# EAGLE design design_block (EAGLE 9.3.0)
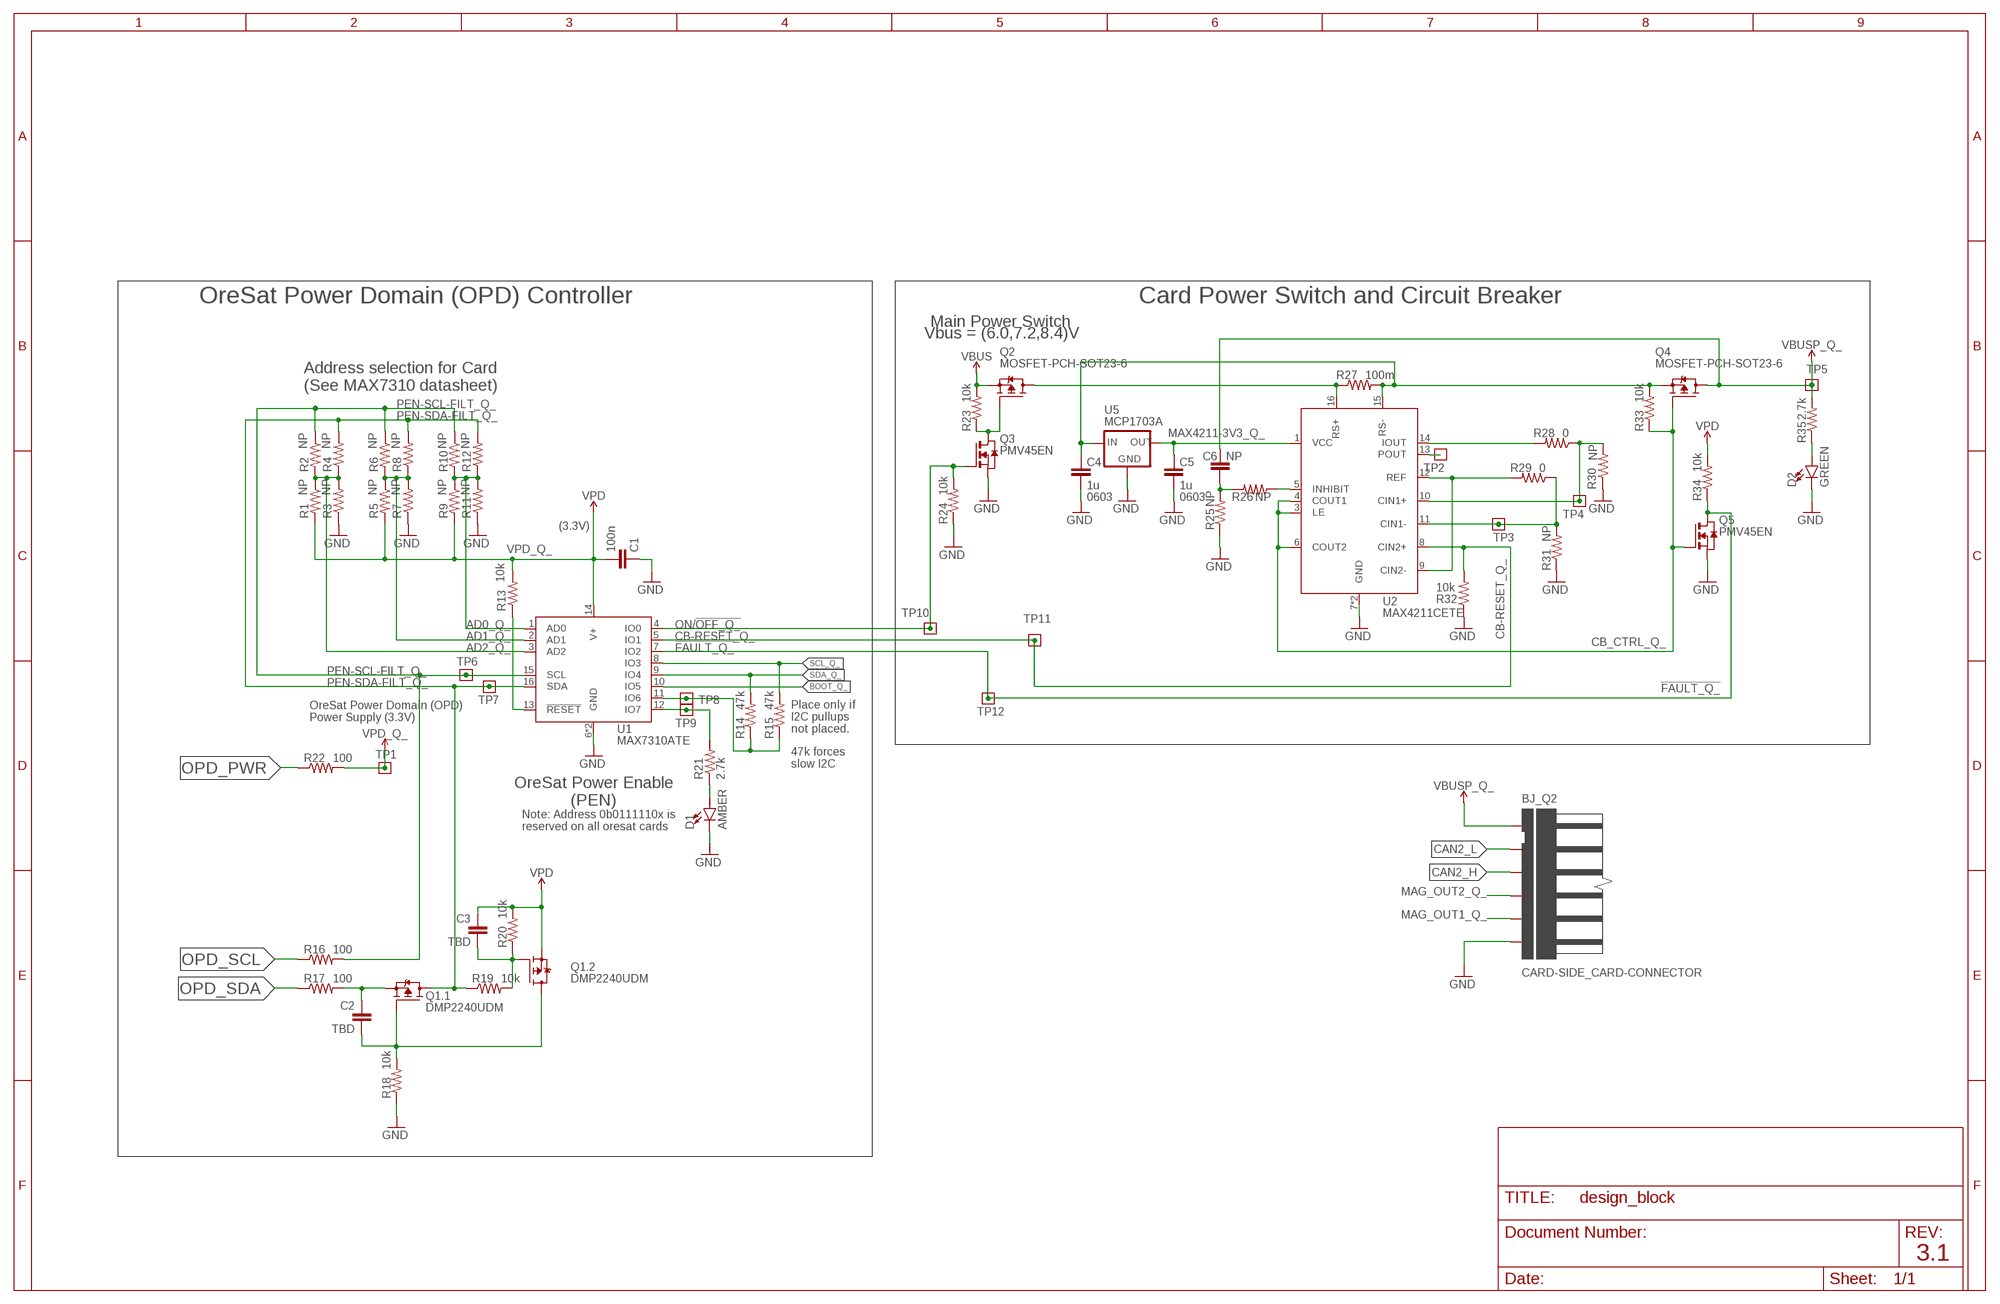
[diagram p0: schematic, sheet 1]

## Parts
BJ_Q2  CARD-SIDE_CARD-CONNECTOR  [14-PIN_FFC-PORT]
C1  100n  C-EU0402-B-NOSILK  [.0402-B-NOSILK]
C2  TBD  C-EU0402-B-NOSILK  [.0402-B-NOSILK]
C3  TBD  C-EU0402-B-NOSILK  [.0402-B-NOSILK]
C4  1u  C-EU0603-B-NOSILK  [.0603-B-NOSILK]
C5  1u  C-EU0603-B-NOSILK  [.0603-B-NOSILK]
C6  NP  C-EU0402-B-NOSILK  [.0402-B-NOSILK]
D1  AMBER  LED-GREEN0603  [LED-0603]
D2  GREEN  LED-GREEN0603  [LED-0603]
Q1  DMP2240UDM  MOSFET-PCH-SOT23-6  [SOT23-6]
Q2  MOSFET-PCH-SOT23-6  [SOT23-6]
Q3  PMV45EN  [SOT23]
Q4  MOSFET-PCH-SOT23-6  [SOT23-6]
Q5  PMV45EN  [SOT23]
R1  NP  R-US_0402-B-NOSILK  [.0402-B-NOSILK]
R2  NP  R-US_0402-B-NOSILK  [.0402-B-NOSILK]
R3  NP  R-US_0402-B-NOSILK  [.0402-B-NOSILK]
R4  NP  R-US_0402-B-NOSILK  [.0402-B-NOSILK]
R5  NP  R-US_0402-B-NOSILK  [.0402-B-NOSILK]
R6  NP  R-US_0402-B-NOSILK  [.0402-B-NOSILK]
R7  NP  R-US_0402-B-NOSILK  [.0402-B-NOSILK]
R8  NP  R-US_0402-B-NOSILK  [.0402-B-NOSILK]
R9  NP  R-US_0402-B-NOSILK  [.0402-B-NOSILK]
R10  NP  R-US_0402-B-NOSILK  [.0402-B-NOSILK]
R11  NP  R-US_0402-B-NOSILK  [.0402-B-NOSILK]
R12  NP  R-US_0402-B-NOSILK  [.0402-B-NOSILK]
R13  10k  R-US_0402-B-NOSILK  [.0402-B-NOSILK]
R14  47k  R-US_0402-B-NOSILK  [.0402-B-NOSILK]
R15  47k  R-US_0402-B-NOSILK  [.0402-B-NOSILK]
R16  100  R-US_0402-B-NOSILK  [.0402-B-NOSILK]
R17  100  R-US_0402-B-NOSILK  [.0402-B-NOSILK]
R18  10k  R-US_0402-B-NOSILK  [.0402-B-NOSILK]
R19  10k  R-US_0402-B-NOSILK  [.0402-B-NOSILK]
R20  10k  R-US_0402-B-NOSILK  [.0402-B-NOSILK]
R21  2.7k  R-US_0402-B-NOSILK  [.0402-B-NOSILK]
R22  100  R-US_0402-B-NOSILK  [.0402-B-NOSILK]
R23  10k  R-US_0402-B-NOSILK  [.0402-B-NOSILK]
R24  10k  R-US_0402-B-NOSILK  [.0402-B-NOSILK]
R25  NP  R-US_0402-B-NOSILK  [.0402-B-NOSILK]
R26  NP  R-US_0402-B-NOSILK  [.0402-B-NOSILK]
R27  100m  R-US_R1206  [R1206]
R28  0  R-US_0402-B-NOSILK  [.0402-B-NOSILK]
R29  0  R-US_0402-B-NOSILK  [.0402-B-NOSILK]
R30  NP  R-US_0402-B-NOSILK  [.0402-B-NOSILK]
R31  NP  R-US_0402-B-NOSILK  [.0402-B-NOSILK]
R32  10k  R-US_0402-B-NOSILK  [.0402-B-NOSILK]
R33  10k  R-US_0402-B-NOSILK  [.0402-B-NOSILK]
R34  10k  R-US_0402-B-NOSILK  [.0402-B-NOSILK]
R35  2.7k  R-US_0402-B-NOSILK  [.0402-B-NOSILK]
TP1  TEST-POINT  [2MM-TEST-POINT]
TP2  TEST-POINT  [2MM-TEST-POINT]
TP3  TEST-POINT  [2MM-TEST-POINT]
TP4  TEST-POINT  [2MM-TEST-POINT]
TP5  TEST-POINT  [2MM-TEST-POINT]
TP6  TEST-POINT  [2MM-TEST-POINT]
TP7  TEST-POINT  [2MM-TEST-POINT]
TP8  TEST-POINT  [2MM-TEST-POINT]
TP9  TEST-POINT  [2MM-TEST-POINT]
TP10  TEST-POINT  [2MM-TEST-POINT]
TP11  TEST-POINT  [2MM-TEST-POINT]
TP12  TEST-POINT  [2MM-TEST-POINT]
U1  MAX7310ATE  MAX7310  [QFN65P400X400X80-17T210]
U2  MAX4211CETE  MAX4211  [QFN65P400X400X80-17T210]
U5  MCP1703A  XC63FPM  [SOT23]

## Nets
!FAULT_Q_: Q5.3(D) R34.1 TP12.1 U1.7(IO2)
AD0_Q_: R9.1 R10.2 R11.2 R12.1 U1.1(AD0)
AD1_Q_: R5.1 R6.2 R7.2 R8.1 U1.2(AD1)
AD2_Q_: R1.1 R2.2 R3.2 R4.1 U1.3(AD2)
BOOT_Q_: U1.10(IO5)
CAN2_H: BJ_Q2.P$6 BJ_Q2.P$7
CAN2_L: BJ_Q2.P$4 BJ_Q2.P$5
CB-RESET_Q_: R32.2 TP11.1 U1.5(IO1) U2.8(CIN2+)
CB_CTRL_Q_: Q4.3(G) Q5.1(G) R33.1 U2.3(LE) U2.4(COUT1) U2.6(COUT2)
GND: BJ_Q2.P$12 BJ_Q2.P$13 BJ_Q2.P$14 BJ_Q2.P$15 BJ_Q2.P$16 C1.1 C4.2 C5.2 D1.C D2.C Q3.2(S) Q5.2(S) R3.1 R7.1 R11.1 R18.1 R24.1 R25.1 R30.1 R31.1 R32.1 U1.6(GND) U1.EPAD(GND) U2.7(GND) U2.EPAD(GND) U5.1(GND)
MAG_OUT1_Q_: BJ_Q2.P$10 BJ_Q2.P$11
MAG_OUT2_Q_: BJ_Q2.P$8 BJ_Q2.P$9
MAX4211-3V3_Q_: C5.1 U2.1(VCC) U5.2(OUT)
N$2: D2.A R35.1
N$3: R13.1 U1.13(!RESET)
N$4: Q2.3(G) Q3.3(D) R23.1
N$5: Q2.1(D) Q2.2(D) Q2.5(D) Q2.6(D) R27.1 U2.16(RS+)
N$6: R28.1 R30.2 TP4.1 U2.10(CIN1+)
N$7: R29.1 R31.2 TP3.1 U2.11(CIN1-)
N$8: R28.2 U2.14(IOUT)
N$9: R29.2 U2.9(CIN2-) U2.12(REF)
N$10: TP2.1 U2.13(POUT)
N$11: R26.1 U2.5(INHIBIT)
N$12: C6.1 R25.2 R26.2
N$13: C4.1 Q4.4(S) R27.2 R33.2 U2.15(RS-) U5.3(IN)
N$14: R21.2 TP9.1 U1.12(IO7)
N$15: D1.A R21.1
N$16: C2.1 Q1.5(.1:S) R17.2
N$17: C2.2 Q1.1(.1:G) Q1.4(.2:D) R18.2
N$18: C3.2 Q1.3(.2:G) R19.2 R20.1
N$19: R14.1 R15.1 TP8.1 U1.11(IO6)
ON/!OFF_Q_: Q3.1(G) R24.2 TP10.1 U1.4(IO0)
OPD_PWR: R22.1
OPD_SCL: R16.1
OPD_SDA: R17.1
PEN-SCL-FILT_Q_: R2.1 R6.1 R10.1 R16.2 TP6.1 U1.15(SCL)
PEN-SDA-FILT_Q_: Q1.6(.1:D) R4.2 R8.2 R12.2 R19.1 TP7.1 U1.16(SDA)
SCL_Q_: R15.2 U1.8(IO3)
SDA_Q_: R14.2 U1.9(IO4)
VBUS: Q2.4(S) R23.2
VBUSP_Q_: BJ_Q2.P$1 BJ_Q2.P$2 BJ_Q2.P$3 C6.2 Q4.1(D) Q4.2(D) Q4.5(D) Q4.6(D) R35.2 TP5.1
VPD_Q_: C1.2 C3.1 Q1.2(.2:S) R1.2 R5.2 R9.2 R13.2 R20.2 R22.2 R34.2 TP1.1 U1.14(V+) ; supply symbol labelled VPD

## Notes on the sheet
- OreSat Power Domain (OPD) Controller | Card Power Switch and Circuit Breaker
- Main Power Switch
- Vbus = (6.0,7.2,8.4)V
- Address selection for Card
  (See MAX7310 datasheet)
- 0603 | 0603
- (3.3V)
- OreSat Power Domain (OPD)
  Power Supply (3.3V)
- Place only if
  I2C pullups
  not placed.
- 47k forces
  slow I2C
- OreSat Power Enable
  (PEN)
- Note: Address 0b0111110x is 
  reserved on all oresat cards
- 3.1

## Library data of the parts
BJ_Q2 = oresat-ACS_driver_board:CARD-SIDE_CARD-CONNECTOR
C1-C3 C6 = rcl_custom:C-EU: CAPACITOR, European symbol; DIS: Digi-Key; DPN: 1276-1001-1-ND; MFR: Samsung; MPN: CL05B104KO5NNNC
C4 C5 = oresat-rcl:C-EU: CAPACITOR, European symbol; DIS: Digi-Key; DPN: 1276-1001-1-ND; MFR: Samsung; MPN: CL05B104KO5NNNC
D1 = SparkFun-LED:LED-GREEN: Green SMD LED Used in manufacturing of various products at SparkFun Packages: 0603 - SMD 0603 package [Product Link] <http://www.futureelectronics.com/en/technologies/semiconductors/optoelectronics/leds/Pages/9894312-LTST-C190GKT.aspx?CrossPart=HSMG-C190&IM=0> LilyPad 1206 - SMD1206 LilyPad package [Product Link] <http://www.futureelectronics.com/en/Technologies/Product.aspx?ProductID=IN150NGHARVATEKCORPORATION2049943&IM=0> 1206 - SMD1206 package [Product Link] <http://www.futureelectronics.com/en/technologies/semiconductors/optoelectronics/leds/Pages/8315665-LTST-C150KGKT.aspx?IM=0> 1206 Bottom Mount -SMD 1206 Bottom Mount [Product Link] <http://www.digikey.com/product-detail/en/lite-on-inc/LTST-C230KGKT/160-1456-1-ND/386854> SparkFun Products: Pro Mini 328 -5V <https://www.sparkfun.com/products/821> RedBoard <https://www.sparkfun.com/products/12757> MP3 Trigger <https://www.sparkfun.com/products/13720> Makey Makey <https://www.sparkfun.com/products/11076>; VALUE: GREEN
D2 = SparkFun-LED:LED-GREEN: Green SMD LED Used in manufacturing of various products at SparkFun Packages: 0603 - SMD 0603 package [Product Link] <http://www.futureelectronics.com/en/technologies/semiconductors/optoelectronics/leds/Pages/9894312-LTST-C190GKT.aspx?CrossPart=HSMG-C190&IM=0> LilyPad 1206 - SMD1206 LilyPad package [Product Link] <http://www.futureelectronics.com/en/Technologies/Product.aspx?ProductID=IN150NGHARVATEKCORPORATION2049943&IM=0> 1206 - SMD1206 package [Product Link] <http://www.futureelectronics.com/en/technologies/semiconductors/optoelectronics/leds/Pages/8315665-LTST-C150KGKT.aspx?IM=0> 1206 Bottom Mount -SMD 1206 Bottom Mount [Product Link] <http://www.digikey.com/product-detail/en/lite-on-inc/LTST-C230KGKT/160-1456-1-ND/386854> SparkFun Products: Pro Mini 328 -5V <https://www.sparkfun.com/products/821> RedBoard <https://www.sparkfun.com/products/12757> MP3 Trigger <https://www.sparkfun.com/products/13720> Makey Makey <https://www.sparkfun.com/products/11076>
Q1 = Q-MOSFET-PCH-dual-SOT23-6:MOSFET-PCH-SOT23-6: Dual P channel MOSFETs in an SOT23-6; MFR: Diodes Inc; MPN: DMP2240UDM
Q2 Q4 = Q-MOSFET-PCH-SOT23-6:MOSFET-PCH-SOT23-6: P channel MOSFET in an SOT23-6; MFR: Diodes Inc; MPN: DMP3050LVT-7
Q3 Q5 = Tova:PMV45EN
R1-R26 R28-R35 = rcl_custom:R-US_: RESISTOR, American symbol; DIS: Digi-Key; DPN: 1276-4275-1-ND; MFR: Samsung; MPN: RC1005F6653CS
R27 = rcl:R-US_: RESISTOR, American symbol; SPICEPREFIX: R
TP1-TP12 = Tova:TEST-POINT
U1 = U-Maxim-MAX7310-I2C-GPIO-expander:MAX7310; MFR: Maxim; MPN: MAX7310ATE
U2 = U-Maxim-MAX4211-power-monitor:MAX4211; MFR: Maxim; MPN: MAX4211CETE
U5 = v-reg:XC63FP: Positiv Voltage Regulators www.torex.co.jp/english/product/pro02/pdf/0201_xc62fp.pdf; MFR: Microchip; MPN: MCP1703AT-3302E/CB

## Board
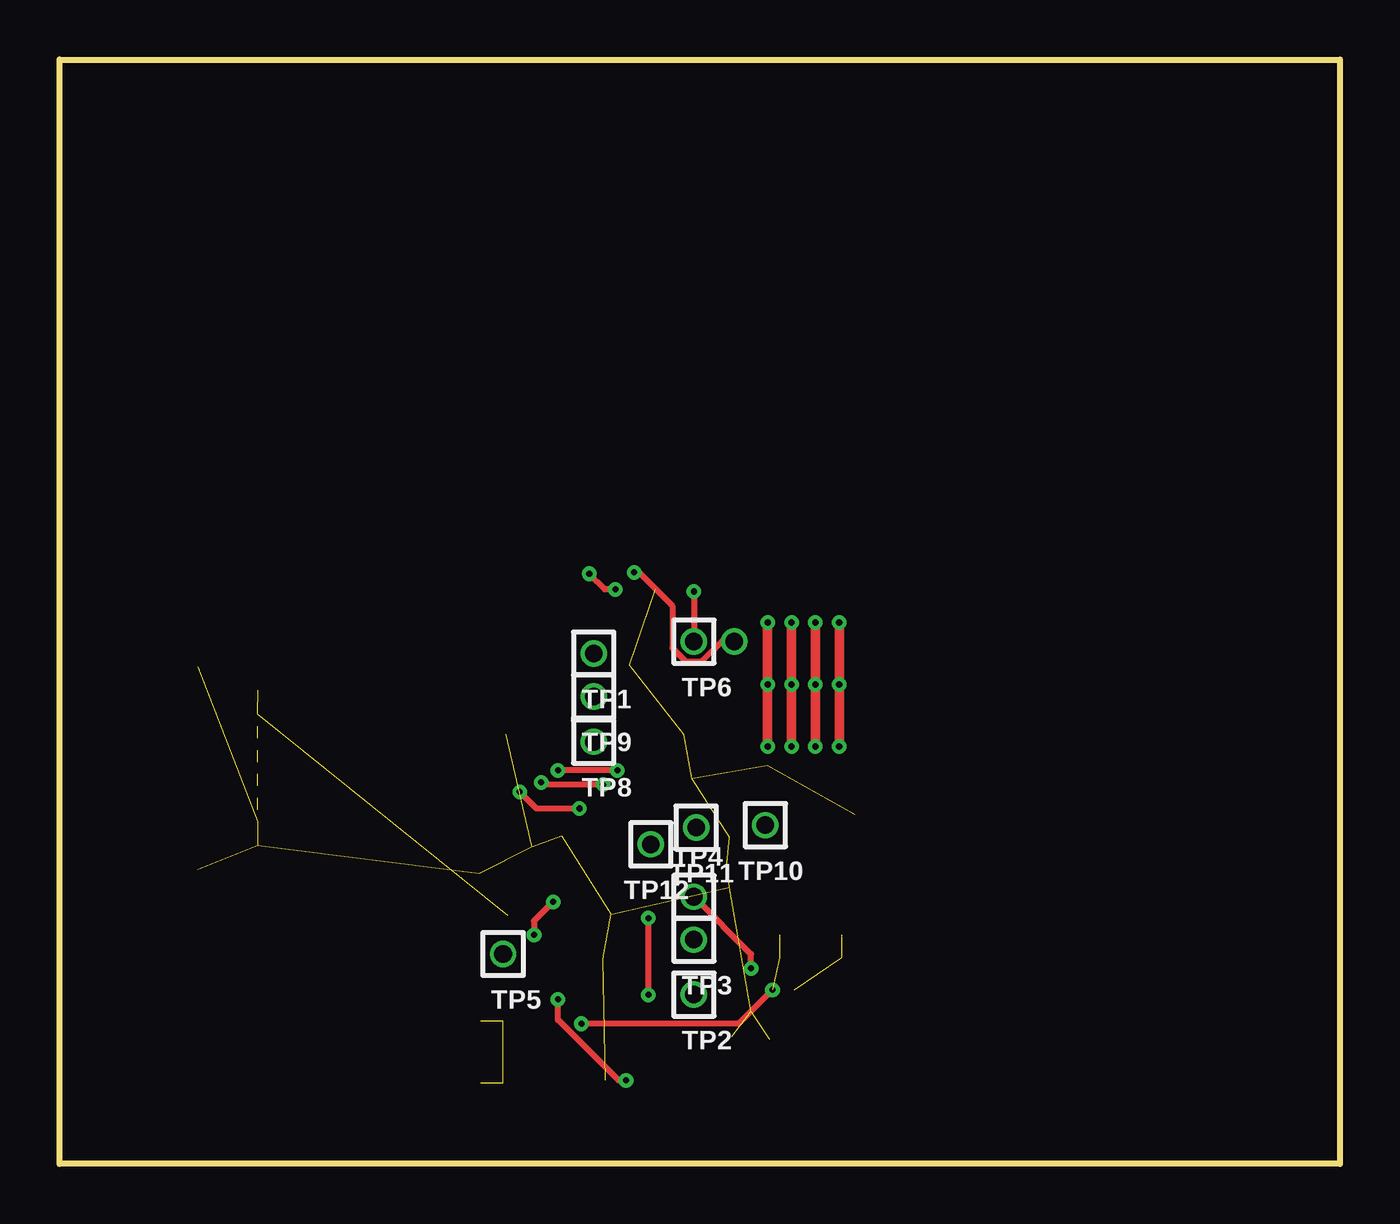
[diagram p1: board, top side]
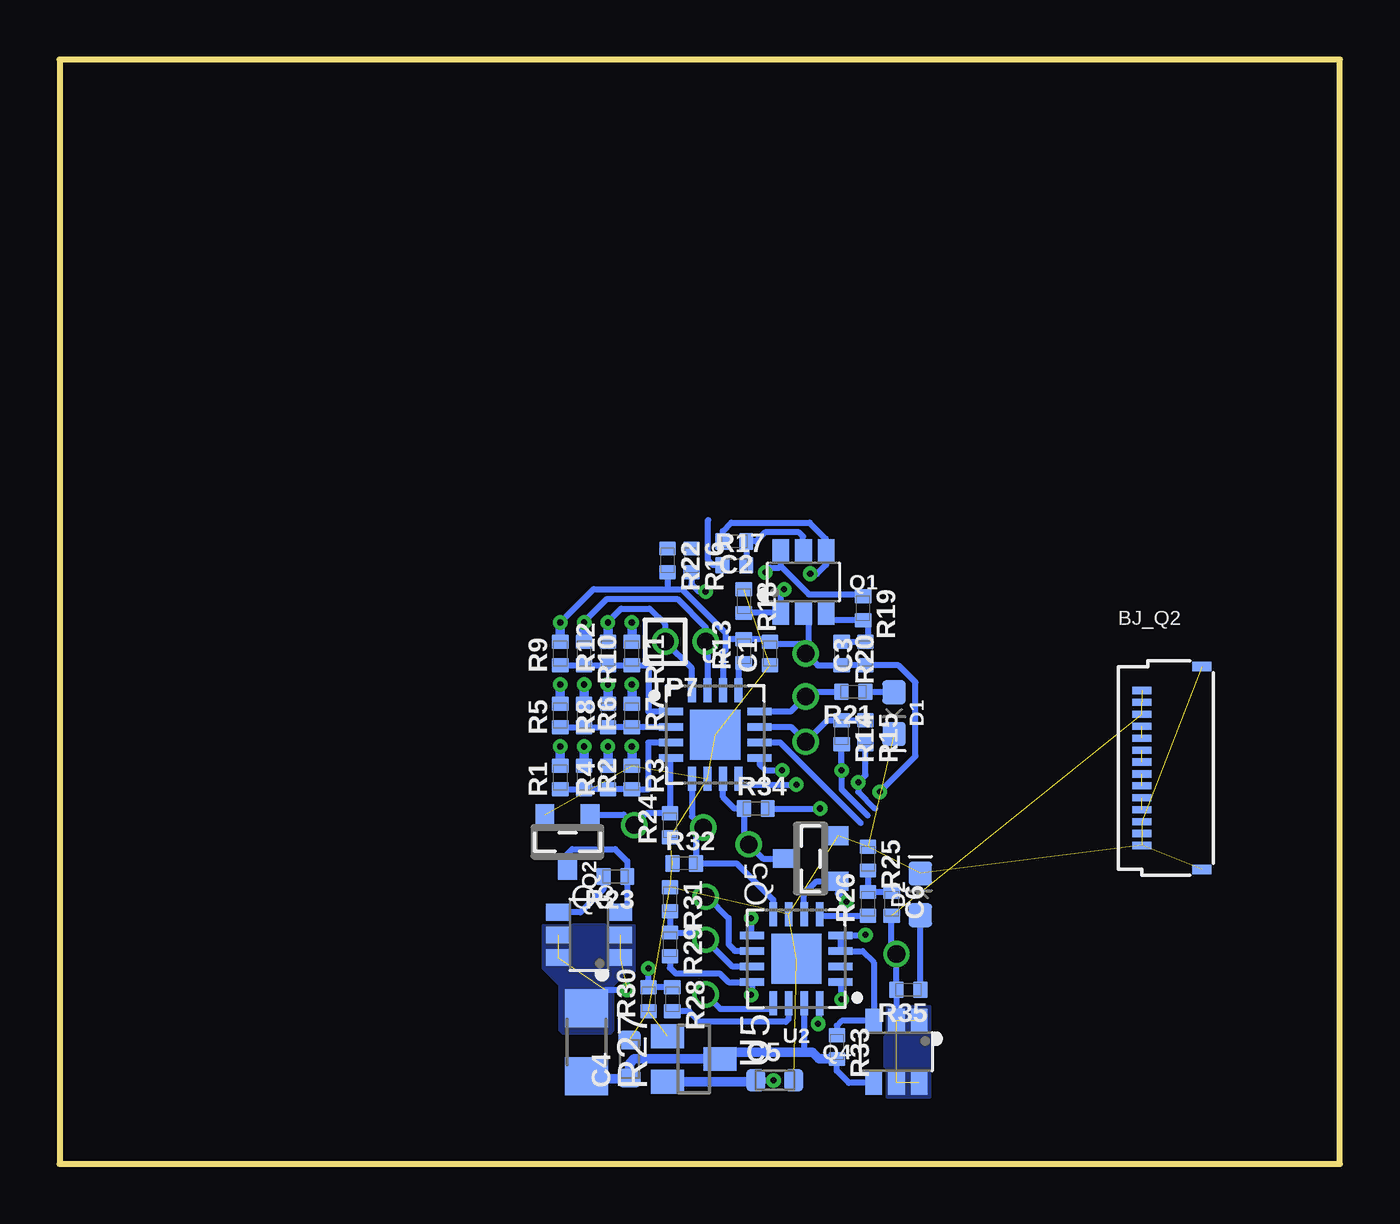
[diagram p2: board, bottom side, seen from below]

Size 53.7 x 46.3 mm. Coordinates in mm from the lower left corner, seen from the top.
Outline: 0,0 0,46.3 53.7,46.3 53.7,0 0,0
Copper layers (1*16): Top 0.0356mm / dielectric 1.5011mm / Bottom 0.0356mm
Design rules "OSH-Park-2-layer *": minimum track width 6mil, minimum drill 10mil, track to track 6mil, track to pad 6mil, pad to pad 6mil, via to via 6mil, smd to smd 6mil, copper to edge 15mil, drill to drill 6mil, minimum pad ring 7mil, minimum via ring 7mil, stop-mask expansion 3mil, vias tented up to drill 13mil, thermal gap 10mil

### Footprints (pad centres in the part's own frame; a part is rotated, then mirrored left to right if it is on the bottom)
14-PIN_FFC-PORT = smd 0.8 x 0.3: P$1 -2,3.25; P$2 -2,2.75; P$3 -2,2.25; P$4 -2,1.75; P$5 -2,1.25; P$6 -2,0.75; P$7 -2,0.25; P$8 -2,-0.25; P$9 -2,-0.75; P$10 -2,-1.25; P$11 -2,-1.75; P$12 -2,-2.25; P$13 -2,-2.75; P$14 -2,-3.25 | smd 0.8 x 0.4: P$15 0.5,4.25; P$16 0.5,-4.25
.0402-B-NOSILK = smd 0.6 x 0.7: 1 -0.5,0; 2 0.5,0
.0603-B-NOSILK = smd 0.8 x 0.95: 1 -0.8,0; 2 0.8,0
LED-0603 = smd 1 x 1: A -0.877,0; C 0.877,0
SOT23-6 = smd 0.7 x 1: 1 -0.95,-1.3; 2 0,-1.3; 3 0.95,-1.3; 4 0.95,1.3; 5 0,1.3; 6 -0.95,1.3
SOT23 = smd 0.787 x 0.889: 1 -0.953,-1.143; 2 0.953,-1.143; 3 0,1.143
R1206 = smd 1.6 x 1.803: 1 -1.422,0; 2 1.422,0
2MM-TEST-POINT = drill 0.737: 1 0,0
QFN65P400X400X80-17T210 = smd 1.01 x 0.32: 1 -1.86,0.975; 2 -1.86,0.325; 3 -1.86,-0.325; 4 -1.86,-0.975; 9 1.86,-0.975; 10 1.86,-0.325; 11 1.86,0.325; 12 1.86,0.975 | smd 0.32 x 1.01: 5 -0.975,-1.86; 6 -0.325,-1.86; 7 0.325,-1.86; 8 0.975,-1.86; 13 0.975,1.86; 14 0.325,1.86; 15 -0.325,1.86; 16 -0.975,1.86 | smd 2.1 x 2.1: EPAD 0,0
SOT23' = smd 1 x 1.4: 1 -0.95,-1.1; 2 0.95,-1.1; 3 0,1.1

### Placement (x,y rotation side)
BJ_Q2  6.3,16.6 0 bottom
C1  23.9,21.4 90 bottom
C2  25.4,26.1 180 bottom
C3  19.9,21.4 90 bottom
C4  29.8,4.4 90 bottom
C5  23.7,3.5 0 bottom
C6  18.8,10.9 270 bottom
D1  18.7,18.9 270 bottom
D2  17.6,11.3 90 bottom
Q1  22.5,24.4 0 bottom
Q2  31.5,9.6 90 bottom
Q3  32.4,13.5 180 bottom
Q4  18.6,4.7 180 bottom
Q5  22.2,12.8 90 bottom
R1  32.7,16.2 90 bottom
R2  31.7,16.2 270 bottom
R3  29.7,16.2 270 bottom
R4  30.7,16.2 90 bottom
R5  32.7,18.8 90 bottom
R6  31.7,18.8 270 bottom
R7  29.7,18.8 270 bottom
R8  30.7,18.8 90 bottom
R9  32.7,21.4 90 bottom
R10  31.7,21.4 270 bottom
R11  29.7,21.4 270 bottom
R12  30.7,21.4 90 bottom
R13  25,21.5 90 bottom
R14  20.9,18.1 270 bottom
R15  19.9,18.1 270 bottom
R16  27.2,25.3 270 bottom
R17  25.4,25.1 0 bottom
R18  25,23.6 270 bottom
R19  20,23.3 270 bottom
R20  20.9,21.4 270 bottom
R21  20.4,19.8 180 bottom
R22  28.2,25.3 270 bottom
R23  30.39,12.05 180 bottom
R24  28.1,14.2 90 bottom
R25  19.8,12.8 270 bottom
R26  19.8,10.9 90 bottom
R27  31.6,5.1 270 bottom
R28  28,6.9 270 bottom
R29  28.1,9.2 270 bottom
R30  29,6.9 90 bottom
R31  28.1,11.1 270 bottom
R32  27.5,12.6 0 bottom
R33  21.1,4.9 270 bottom
R34  24.5,14.9 0 bottom
R35  18.1,7.3 180 bottom
TP1  22.4,21.4 180 top
TP2  26.6,7.1 180 top
TP3  26.6,9.4 180 top
TP4  26.6,11.2 0 top
TP5  18.6,8.8 180 top
TP6  26.6,21.9 180 top
TP7  28.3,21.9 180 bottom
TP8  22.4,17.7 180 top
TP9  22.4,19.6 180 top
TP10  29.6,14.2 180 top
TP11  26.7,14.1 180 top
TP12  24.8,13.4 180 top
U1  26.2,18 0 bottom
U2  22.8,8.6 180 bottom
U5  MCP1703A  [SOT23']  27.1,4.4 270 bottom

### Tracks (layer width: path | path; a pad name or v marks a point on that pad's centre or on a via)
!FAULT_Q_
  Bottom 0.254: U1.7 25.88,15.38 25.4,14.9 R34.1 25,13.6 TP12.1 24.2,12.8 Q5.3
AD0_Q_
  Bottom 0.254: R9.1 R10.2 R12.1 R11.2 29,20.9 29,18.98 U1.1
AD1_Q_
  Bottom 0.254: R5.1 R6.2 R8.1 R7.2 28.09,18.3 U1.2
AD2_Q_
  Bottom 0.254: R1.1 R2.2 R4.1 R3.2 29,15.7 29,17.68 U1.3
BOOT_Q_
  Bottom 0.254: U1.10 23.48,17.68 20.1,14.3
CAN2_H  (1 unrouted)
CAN2_L  (1 unrouted)
CB-RESET_Q_
  Bottom 0.254: U1.5 27.18,14.57 TP11.1 27,13.8 R32.2 25.3,12.6 23.77,11.07 U2.8
CB_CTRL_Q_  (via drill 0.25)
  Top 0.254: v20.7,10.98 19.9,10.18 v19.9,9.6
  Bottom 0.254: U2.6 22.48,11.32 21.95,11.85 Q5.1 21.06,11.34 v20.7,10.98 | U2.4 U2.3 20.02,8.93 19.55,8.45 Q4.3 20.9,6 21.1,5.8 R33.1 | 20.9,9.62 U2.4 | v19.9,9.6 19.93,9.57 U2.4
GND  (via drill 0.25)  (23 unrouted)
  Top 0.4: v29.7,17.5 v29.7,20.1 v29.7,22.7
  Bottom 0.4: R3.1 v29.7,17.5 | v29.7,20.1 R7.1 | R11.1 v29.7,22.7
MAG_OUT1_Q_  (1 unrouted)
MAG_OUT2_Q_  (1 unrouted)
MAX4211-3V3_Q_  (via drill 0.25)
  Top 0.254: v23.76,3.5 23.44,3.5 20.9,6.04 v20.9,6.9
  Bottom 0.254: C5.1 v23.76,3.5 | v20.9,6.9 20.9,7.58 U2.1
  Bottom 0.4: U5.2 24.55,3.45 C5.1
N$2
  Bottom 0.254: R35.1 D2.A
N$3
  Bottom 0.254: R13.1 25.23,20.77 U1.13
N$4
  Bottom 0.254: Q3.3 32.4,13 32.2,13.2 30.4,13.2 29.89,12.69 R23.1 29.89,10.86 Q2.3
N$5  (via drill 0.25)  (4 unrouted)
  Top 0.254: v29.9,7.3 28.48,5.88 v21.89,5.88
  Bottom 0.254: R27.1 30.82,7.3 v29.9,7.3 | v21.89,5.88 21.82,5.94 U2.16
  pour Bottom (no thermals): 29.6,10 33.4,10 33.4,8.2 32.7,7.5 32.7,5.6 32.6,5.5 30.6,5.5 30.5,5.6 30.5,7.5 29.9,8.1 29.6,8.1
N$6  (via drill 0.25)
  Top 0.254: v29,8.2 29,8.8 TP4.1
  Bottom 0.254: TP4.1 26.54,11.2 25.64,10.31 25.64,9.2 25.38,8.94 24.67,8.94 U2.10 | R28.1 R30.2 v29,8.2
N$7
  Bottom 0.254: U2.11 25.48,8.28 TP3.1 26.9,9.7 R29.1 R31.2
N$8
  Bottom 0.254: U2.14 23.12,6.08 23.24,5.96 26.86,5.96 27.3,6.4 R28.2
N$9  (via drill 0.25)
  Top 0.254: v24.7,7.08 v24.7,10.3
  Bottom 0.254: R29.2 28.1,8.22 27.86,7.99 26.01,7.99 25.65,7.62 U2.12 24.66,7.12 v24.7,7.08 | v24.7,10.3 24.7,9.62 U2.9
N$10
  Bottom 0.254: TP2.1 26,6.5 23.77,6.5 U2.13
N$11
  Bottom 0.254: U2.5 21.77,10.4 R26.1
N$12
  Bottom 0.254: R25.2 R26.2 C6.1
N$13
  Bottom 0.254: U2.15 22.48,4.71 22.5,4.68 | Q4.4 20.6,3.4 21.1,3.9 R33.2
  Bottom 0.4: R27.2 31.5,3.58 29.82,3.58 C4.1 29.8,4.2 29.6,4.4 U5.3 25.72,4.68 22.5,4.68 22.12,4.68 21.84,4.4 R33.2
N$14
  Bottom 0.254: U1.12 23.02,18.98 TP9.1 22.2,19.8 R21.2
N$15
  Bottom 0.254: R21.1 18.72,19.8 D1.A
N$16
  Bottom 0.254: Q1.5 22.52,25.72 22.52,26.32 22.68,26.48 24.12,26.48 24.5,26.1 C2.1 R17.2
N$17  (via drill 0.25)
  Top 0.254: v23.31,24.09 22.87,24.09 v22.22,24.74
  Bottom 0.254: R18.2 Q1.1 23.45,23.95 v23.31,24.09 | C2.2 25.88,26.12 25.88,26.54 25.53,26.89 22.24,26.89 21.57,26.22 21.57,25.72 Q1.4 21.55,25.12 21.93,24.74 v22.22,24.74
N$18
  Bottom 0.254: Q1.3 21.25,22.8 R19.2 19.8,22.6 19.8,21.9 C3.2 R20.1
N$19
  Bottom 0.254: R15.1 R14.1 21.5,18.6 TP8.1 23.02,18.32 U1.11
ON/!OFF_Q_
  Bottom 0.254: U1.4 28.1,16.98 R24.2 29.1,14.7 TP10.1 30.04,14.64 Q3.1
OPD_SDA
  Bottom 0.254: R17.1 26.3,25.1 26.5,25.3 26.5,27
PEN-SCL-FILT_Q_  (via drill 0.25)
  Top 0.254: v26.6,24 TP6.1
  Top 0.4: v31.7,17.5 v31.7,20.1 v31.7,22.7
  Bottom 0.254: U1.15 26.52,21.82 TP6.1 26.6,22.5 27.79,23.69 30.74,23.69 31.7,22.73 v31.7,22.7 | R16.2 27.2,24.3 26.9,24 v26.6,24
  Bottom 0.4: R2.1 v31.7,17.5 | v31.7,20.1 R6.1 | R10.1 v31.7,22.7
PEN-SDA-FILT_Q_  (via drill 0.25)
  Top 0.254: v24.1,24.8 24.3,24.8 25.7,23.4 25.7,21.62 26.25,21.07 26.95,21.07 27.78,21.9 TP7.1
  Top 0.4: v30.7,17.5 v30.7,20.1 v30.7,22.7
  Bottom 0.254: v30.7,22.7 30.7,22.73 30.14,23.28 28.96,23.28 28.32,22.64 28.32,21.92 TP7.1 27.18,20.77 U1.16 | R19.1 20.08,23.88 22.28,23.88 23.45,25.05 | 23.45,25.05 Q1.6 | 23.45,25.05 23.5,25 23.9,25 v24.1,24.8
  Bottom 0.4: R4.2 v30.7,17.5 | v30.7,20.1 R8.2 | R12.2 v30.7,22.7
SCL_Q_  (via drill 0.25)
  Top 0.254: v22.8,15.9 20.3,15.9 v20.2,16
  Bottom 0.254: U1.8 24.98,15.9 v22.8,15.9 | R15.2 19.9,16.3 v20.2,16 20.2,15.6 19.5,14.9
SDA_Q_  (via drill 0.25)
  Top 0.254: v23.4,16.5 v20.9,16.5
  Bottom 0.254: U1.9 24.34,16.74 24.1,16.5 v23.4,16.5 | R14.2 v20.9,16.5 20.9,15.7 19.8,14.6
VBUS
  Bottom 0.254: R23.2 30.89,11.51 31.85,10.55 Q2.4
VBUSP_Q_  (6 unrouted)
  Bottom 0.254: C6.2 18.8,9 TP5.1 R35.2 Q4.2
  pour Bottom (no thermals): 17.2,6.6 19,6.6 19.1,6.5 19.1,2.9 19,2.8 17.2,2.8
VPD_Q_  (via drill 0.25)
  Top 0.254: v21.8,14.9 20,14.9 v19.3,15.6
  Top 0.4: v32.7,17.5 v32.7,20.1 v32.7,22.7
  Bottom 0.254: v32.7,22.7 31.3,24.1 28.2,24.1 | U1.14 25.88,21.45 25.77,21.55 25.77,22 | 28.2,24.1 27.6,24.1 25.77,22.27 25.77,22 | 25.77,22 R13.2 24,22 C1.2 23.8,21.8 22.4,21.8 | 22.4,21.8 22.3,21.8 22.3,22.9 Q1.2 | 22.4,21.8 TP1.1 21.9,20.9 R20.2 C3.1 18.52,20.9 17.8,20.18 17.8,17.1 v19.3,15.6 | R34.2 v21.8,14.9 | R22.2 28.2,24.1
  Bottom 0.4: R1.2 v32.7,17.5 | v32.7,20.1 R5.2 | R9.2 v32.7,22.7